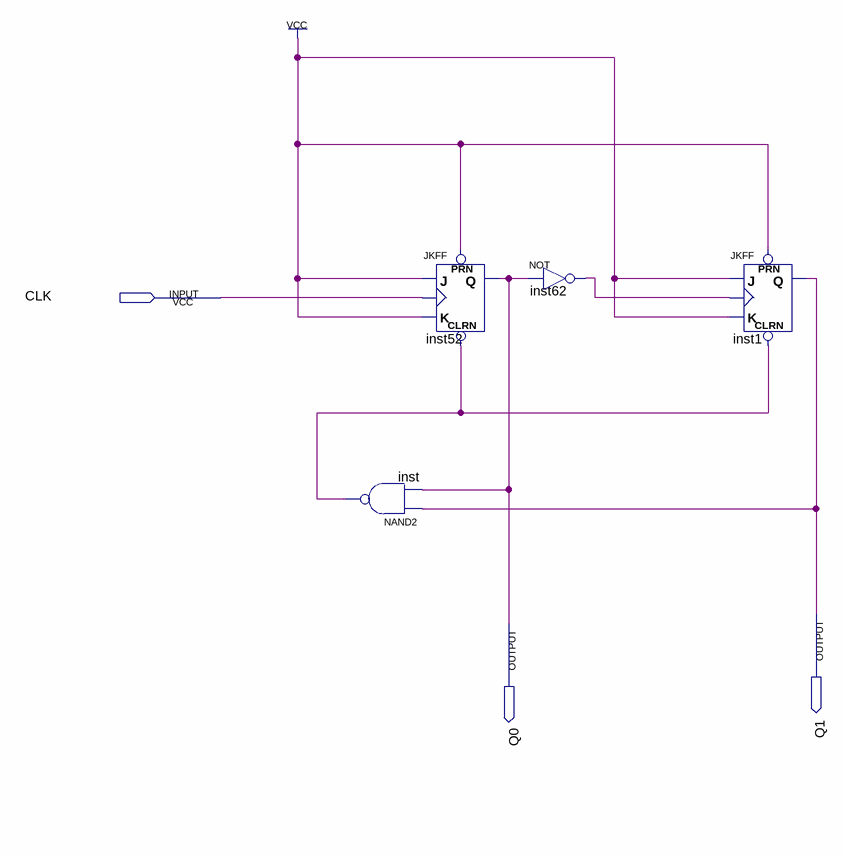
[diagram p0: schematic sheet]
// Quartus schematic ModCuatroTruncadoTres.bdf as structural Verilog: 4 symbols, 3 pins
module ModCuatroTruncadoTres (
  input  CLK,
  output Q1,
  output Q0
);

  wire inst62_out, inst_out;

  nand inst (inst_out, Q1, Q0);
  JKFF inst52 (.PRN(1'b1), .CLRN(inst_out), .K(1'b1), .J(1'b1), .CLK(CLK), .Q(Q0));
  not inst62 (inst62_out, Q0);
  JKFF inst1 (.PRN(1'b1), .CLRN(inst_out), .K(1'b1), .J(1'b1), .CLK(inst62_out), .Q(Q1));
endmodule
